# EAGLE design CanBusArduino (EAGLE 9.2.2)
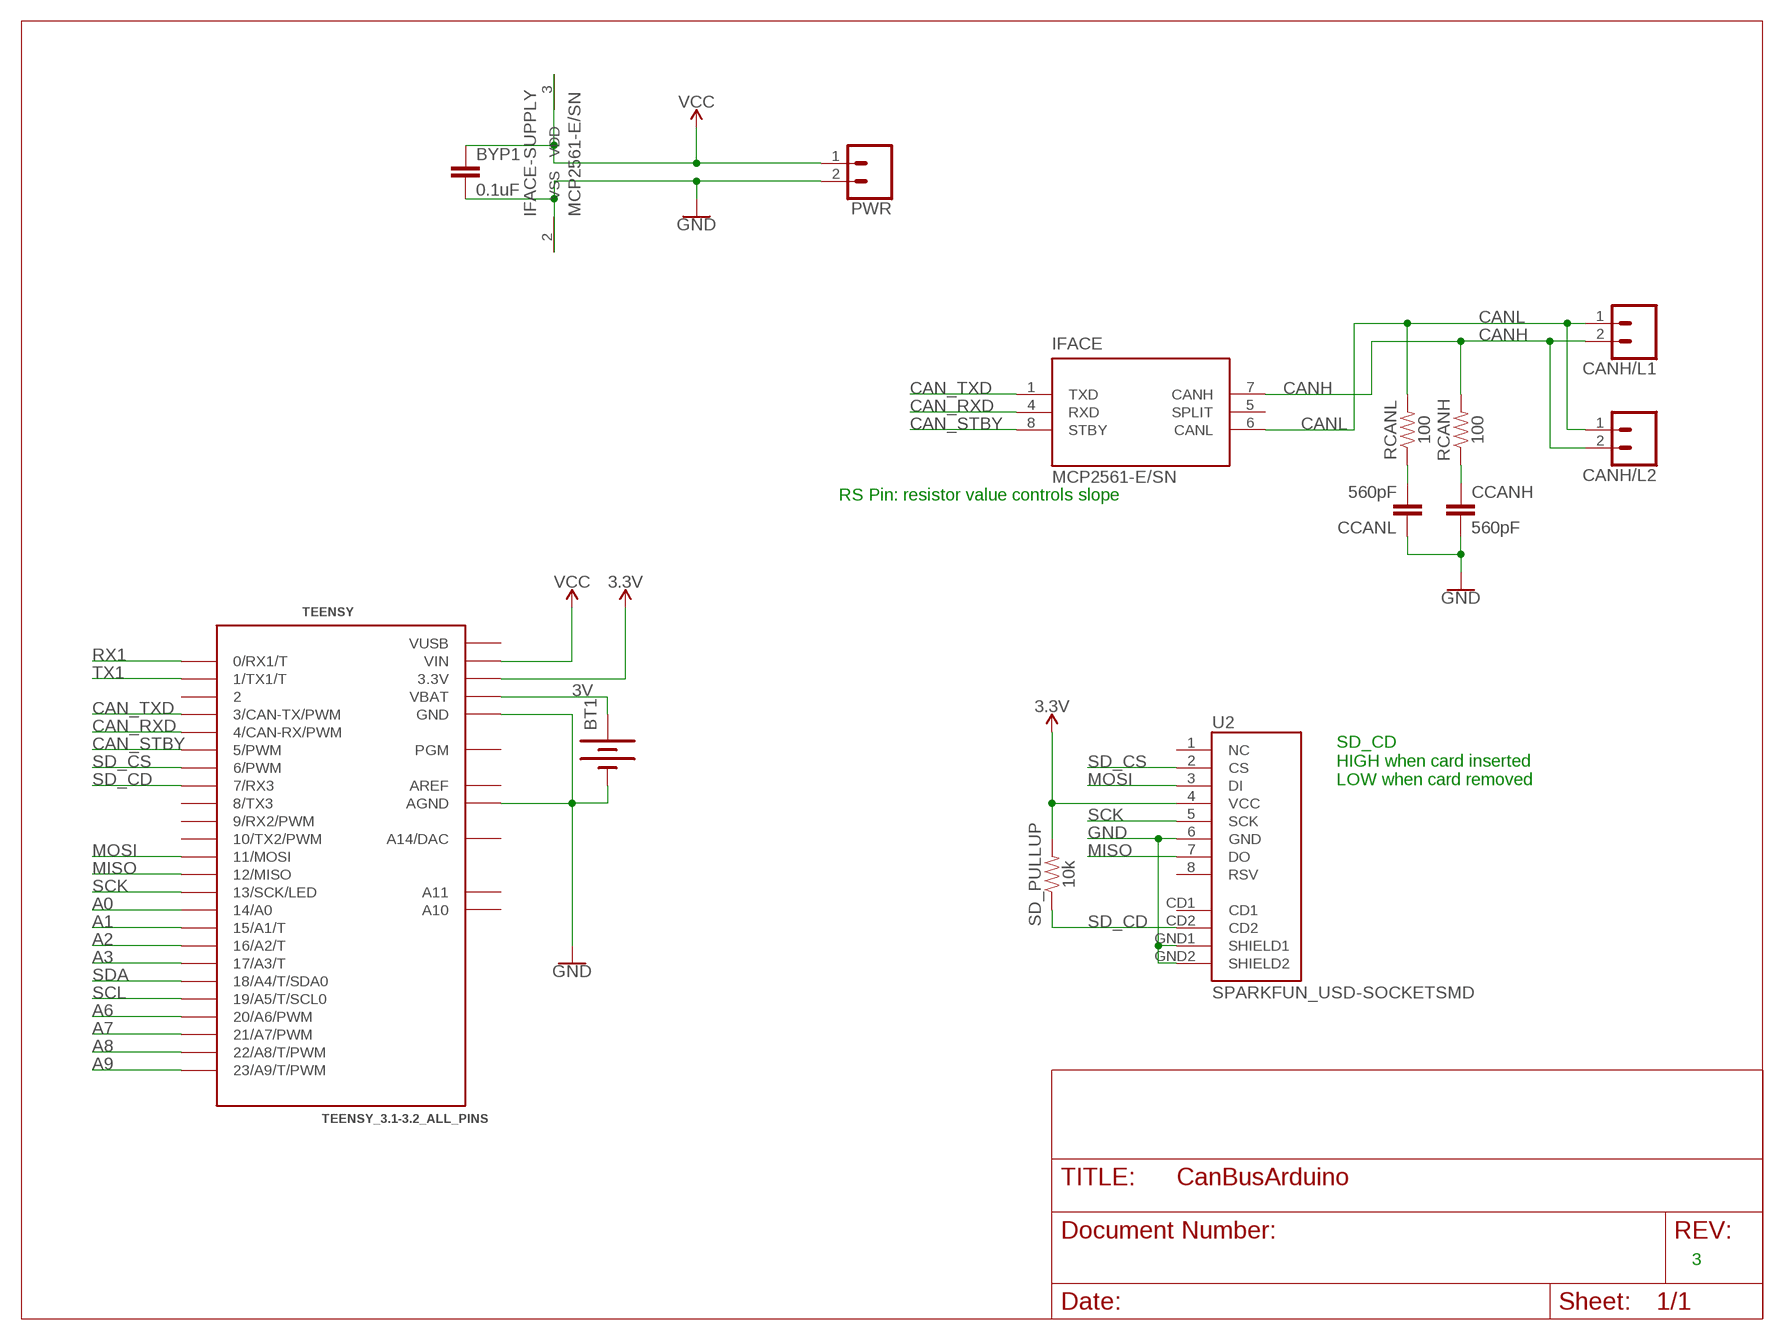
[diagram p0: schematic, sheet 1]

## Parts
BT1  BATTERY-20MM_SMD_4LEGS  [BATTCON_20MM_4LEGS]
BYP1  0.1uF  0.1UF-0603-100V-10%  [0603]
CANH/L1  CONN_02POLAR  [MOLEX-1X2]
CANH/L2  CONN_02POLAR  [MOLEX-1X2]
CCANH  560pF  560PF-0603-50V-5%  [0603]
CCANL  560pF  560PF-0603-50V-5%  [0603]
IFACE  MCP2561-E/SN  [SOIC-8]
PWR  CONN_02POLAR  [MOLEX-1X2]
RCANH  100  100OHM-0603-1/4W-5%  [0603]
RCANL  100  100OHM-0603-1/4W-5%  [0603]
SD_PULLUP  10k  10KOHM-0603-1/10W-1%  [0603]
TEENSY  TEENSY_3.1-3.2_ALL_PINS  [TEENSY_3.0-3.2&LC_ALL_PINS]
U2  SPARKFUN_USD-SOCKETSMD  [SPARKFUN_MICRO-SD-SOCKET-PP]

## Nets
3.3V: SD_PULLUP.2 TEENSY.3.3V TEENSY.3.3V1(3.3V) U2.4(VCC)
3V: BT1.POSITIVE@1(+) BT1.POSITIVE@2(+) BT1.POSITIVE@3(+) BT1.POSITIVE@4(+) TEENSY.VBAT
A0: TEENSY.14/A0
A1: TEENSY.15/A1(15/A1/T)
A2: TEENSY.16/A2(16/A2/T)
A3: TEENSY.17/A3(17/A3/T)
A6: TEENSY.20/A6(20/A6/PWM)
A7: TEENSY.21/A7(21/A7/PWM)
A8: TEENSY.22/A8(22/A8/T/PWM)
A9: TEENSY.23/A9(23/A9/T/PWM)
CAN_RXD: IFACE.4(RXD) TEENSY.4(4/CAN-RX/PWM)
CAN_STBY: IFACE.8(STBY) TEENSY.5(5/PWM)
CAN_TXD: IFACE.1(TXD) TEENSY.3(3/CAN-TX/PWM)
CANH: CANH/L1.2 CANH/L2.2 IFACE.7(CANH) RCANH.2
CANL: CANH/L1.1 CANH/L2.1 IFACE.6(CANL) RCANL.2
GND: BT1.NEGATIVE(-) BYP1.2 CCANH.2 CCANL.1 IFACE.2(VSS) PWR.2 TEENSY.AGND TEENSY.GND TEENSY.GND1(GND) U2.6(GND) U2.GND1(SHIELD1) U2.GND2(SHIELD2)
MISO: TEENSY.12(12/MISO) U2.7(DO)
MOSI: TEENSY.11(11/MOSI) U2.3(DI)
N$6: CCANL.2 RCANL.1
N$7: CCANH.1 RCANH.1
RX1: TEENSY.0(0/RX1/T)
SCK: TEENSY.13(13/SCK/LED) U2.5(SCK)
SCL: TEENSY.19/A5(19/A5/T/SCL0)
SD_CD: SD_PULLUP.1 TEENSY.7(7/RX3) U2.CD2
SD_CS: TEENSY.6(6/PWM) U2.2(CS)
SDA: TEENSY.18/A4(18/A4/T/SDA0)
TX1: TEENSY.1(1/TX1/T)
VCC [1A]: BYP1.1 IFACE.3(VDD) PWR.1 TEENSY.VIN
Unconnected: IFACE.5(SPLIT) TEENSY.2 TEENSY.8(8/TX3) TEENSY.9(9/RX2/PWM) TEENSY.10(10/TX2/PWM) TEENSY.A10 TEENSY.A11 TEENSY.PGM TEENSY.RESET/DAC(A14/DAC) U2.1(NC) U2.8(RSV) U2.CD1

## Notes on the sheet
- RS Pin: resistor value controls slope
- SD_CD
  HIGH when card inserted
  LOW when card removed
- 3

## Power pins joined to a net without a drawn wire
AREF: TEENSY.AREF
VUSB: TEENSY.VUSB

## Library data of the parts
BT1 = SparkFun-Batteries:BATTERY: Battery - Single Cell A variety of battery chemistries, sizes, and footprints. Device List: 20MM_PTH - Coin Cell Battery Holder - 20mm (PTH) <https://www.sparkfun.com/products/783> 6.8MM_PTH - Coin Cell Battery Holder - 6.8MM(SMD) <https://www.digikey.com/product-detail/en/seiko-instruments/MS621FE-FL11E/728-1057-ND/1889208?WT.srch=1&gclid=CNOQ5a6LzdQCFZS2wAodXCkE0g> 12MM_SMD - Coin Cell Battery Holder - 12mm (SMD) <https://www.sparkfun.com/products/10592> 12MM_PTH - Coin Cell Battery Holder - 12mm (PTH) <https://www.sparkfun.com/products/7948> 20MM_SMD - 20mm Coin Cell Battery Holder (SMD) (2 legs) Used on the Big Time Watch Kit <https://www.sparkfun.com/products/11734> 20MM_SMD_4LEGS - Coin Cell Battery Holder - 20mm (SMD) <https://www.sparkfun.com/products/11892> 20MM_SMD_4LEGS_OVERPASTE - Coin Cell Battery Holder - 20mm (SMD) <https://www.sparkfun.com/products/11892> (Over-paste on the legs) 24.5MM_PTH - Coin Cell Battery Holder - 24.5mm (PTH) <https://www.sparkfun.com/products/8863> 9V - 9V Battery Holder - PC Mount Used on the SparkFun SparkPunk Sound Kit <https://www.sparkfun.com/products/11177> and SparkFun SparkPunk Sequencer Kit <https://www.sparkfun.com/products/12707> 18650 - Battery Holder - 18650 (PTH) <https://www.sparkfun.com/products/13113> AA - Battery Holder - 1xAA (PTH) <https://www.sparkfun.com/products/7949> AAA - Battery Holder - 1xAAA (PTH) <https://www.sparkfun.com/products/12718> AA_KIT - Battery Holder - 1xAA (PTH) <https://www.sparkfun.com/products/7949> Special kit package - pads only have exposed copper on one side of the board. AAA_KIT - Battery Holder - 1xAAA (PTH) <https://www.sparkfun.com/products/12718> Special kit package - pads only have exposed copper on one side of the board.; PROD_ID: BATT-10373; SF_SKU: PRT-11892
BYP1 = SparkFun-Capacitors:0.1UF: 0.1µF ceramic capacitors A capacitor is a passive two-terminal electrical component used to store electrical energy temporarily in an electric field.; PROD_ID: CAP-08390
CANH/L1 CANH/L2 PWR = SparkFun-Connectors:CONN_02: Multi connection point. Often used as Generic Header-pin footprint for 0.1 inch spaced/style header connections On any of the 0.1 inch spaced packages, you can populate with these: Break Away Headers - Straight <https://www.sparkfun.com/products/116> (PRT-00116) Break Away Male Headers - Right Angle <https://www.sparkfun.com/products/553> (PRT-00553) Female Headers <https://www.sparkfun.com/products/115> (PRT-00115) Break Away Headers - Machine Pin <https://www.sparkfun.com/products/117> (PRT-00117) Break Away Female Headers - Swiss Machine Pin <https://www.sparkfun.com/products/743> (PRT-00743) For SCREWTERMINALS and SPRING TERMINALS visit here: Screw Terimnals on SparkFun.com <https://www.sparkfun.com/search/results?term=Screw+Terminals> (5mm/3.5mm/2.54mm spacing) This device is also useful as a general connection point to wire up your design to another part of your project. Our various solder wires solder well into these plated through hole pads. Hook-Up Wire - Assortment (Stranded, 22 AWG) <https://www.sparkfun.com/products/11375> (PRT-11375) Hook-Up Wire - Assortment (Solid Core, 22 AWG) <https://www.sparkfun.com/products/11367> (PRT-11367) View the entire wire category on our website here <https://www.sparkfun.com/categories/141> Special notes: Molex polarized connector foot print use with: PRT-08233 with associated crimp pins and housings. 2.54_SCREWTERM for use with PRT-10571. 3.5mm Screw Terminal footprints for PRT-08084 5mm Screw Terminal footprints for use with PRT-08432; SF_ID: PRT-09918
CCANH CCANL = SparkFun-Capacitors:560PF: 0.56nF/560pF ceramic capacitors A capacitor is a passive two-terminal electrical component used to store electrical energy temporarily in an electric field.; PROD_ID: CAP-08749
IFACE = Volks73-MicrochipTechnology:MCP2561-*/?: High-Speed CAN Transceiver Documentation Datasheet <http://ww1.microchip.com/downloads/en/DeviceDoc/20005167C.pdf> General Description The MCP2561/2 is a Microchip Technology Inc. second generation high-speed CAN transceiver. It serves as an interface between a CAN protocol controller and the physical two-wire CAN bus. The device meets the automotive requirements for high-speed (up to 1 Mb/s), low quiescent current, electromagnetic compatibility (EMC) and electrostatis discharge (ESD). Features Supports 1 Mb/s Operation Implements ISO-11898-2 and ISO-11898-5 Standard Physical Layer Requirements Very Low Standby Current (5 µA, typical) VIO Supply Pin to Interface Directly to CAN Controllers and Microcontrollers with 1.8V to 5.5V I/O SPLIT Output Pin to Stabilize Common Mode in Biased Split Termination Schemes CAN Bus Pins are Disconnected when Device is Unpowered: An Unpowered Node or Brown-Out Event will Not Load the CAN Bus Detection of Ground Fault: Permanent Dominant Detection on TXD Permanent Dominant Detection on Bus Power-on Reset and Voltage Brown-Out Protection on VDD Pin Protection Against Damage Due to Short-Circuit Conditions (Positive or Negative Battery Voltage) Protection Against High-Voltage Transients in Automotive Environments Automatic Thermal Shutdown Protection Suitable for 12V and 24V Systems Meets or exceeds stringent automotive design requirements including “Hardware Requirements for LIN, CAN and FlexRay Interfaces in Automotive Applications”, Version 1.3, May 2012 High-Noise Immunity Due to Differential Bus Implementation High Electrostatic Discharge (ESD) Protection on CANH and CANL, meeting the IEC61000-4-2 up to ±14 kV Available in PDIP-8L, SOIC-8L and 3x3 DFN-8L Temperature ranges: Extended (E): -40°C to +125°C High (H): -40°C to +150°C; CATEGORY: Integrated Circuits (ICs); DATA_RATE: -; DESCRIPTION: IC TXRX CAN 8SOIC; DOCUMENTATION_LINK: <a href="http://ww1.microchip.com/downloads/en/DeviceDoc/20005167C.pdf">Datasheet</a>; DOCUMENTATION_URL: http://ww1.microchip.com/downloads/en/DeviceDoc/20005167C.pdf; DUPLEX: Full; FAMILY: Interface - Drivers, Receivers, Transceivers; MANUFACTURER: Microchip Technology; MOUNTING_TYPE: Surface Mount; NUMBER_OF_DRIVERS-RECEIVERS: 1/1; OPERATING_TEMPERATURE: -40°C ~ 125°C; PACKAGE_CASE: 8-SOIC (0.154", 3.90mm Width); PART_NUMBER: MCP2561-E/SN; PROTOCOL: CAN; RECEIVER_HYSTERSIS: -; SERIES: -; SUPPLIER_DEVICE_PACKAGE: 8-SOIC N; SUPPLIER_ITEM_INFO: http://www.digikey.com/product-detail/en/MCP2561-E%2FSN/MCP2561-E%2FSN-ND/4079961; SUPPLIER_ITEM_LINK: <a href="http://www.digikey.com/product-detail/en/MCP2561-E%2FSN/MCP2561-E%2FSN-ND/4079961">Details</a>; SUPPLIER_ITEM_NUMBER: MCP2561-E/SN-ND; SUPPLIER_ITEM_URL: http://www.digikey.com/product-detail/en/MCP2561-E%2FSN/MCP2561-E%2FSN-ND/4079961; SUPPLIER_LINK: <a href="http://www.digikey.com">Home Page</a>; SUPPLIER_NAME: Digi-Key; SUPPLIER_URL: http://www.digikey.com; TYPE: Transceiver; VOLTAGE-SUPPLY: 4.5 V ~ 5.5 V
RCANH RCANL = SparkFun-Resistors:100OHM: 100Ω resistor A resistor is a passive two-terminal electrical component that implements electrical resistance as a circuit element. Resistors act to reduce current flow, and, at the same time, act to lower voltage levels within circuits. - Wikipedia; PROD_ID: RES-12438
SD_PULLUP = SparkFun-Resistors:10KOHM: 10kΩ resistor A resistor is a passive two-terminal electrical component that implements electrical resistance as a circuit element. Resistors act to reduce current flow, and, at the same time, act to lower voltage levels within circuits. - Wikipedia; PROD_ID: RES-00824
TEENSY = Teensy_3_and_LC_Series_Boards_v1.4:TEENSY_3.1-3.2_ALL_PINS: Footprint for Teensy 3.1 or 3.2 board using all through-holes, i.e. the entire perimeter plus the 4 through-holes inboard (A10,A11,AREF, VUSB)
U2 = microSD-Breakout-v14:SPARKFUN_USD-SOCKET: microSD Socket Push-push type uSD socket. Schematic element and footprint production proven. Spark Fun Electronics SKU : PRT-00127. tDoc lines correctly indicate media card edge positions when inserting (unlocked, locked, depressed).

## Net classes
1 1A: width 0.4 mm

## Board
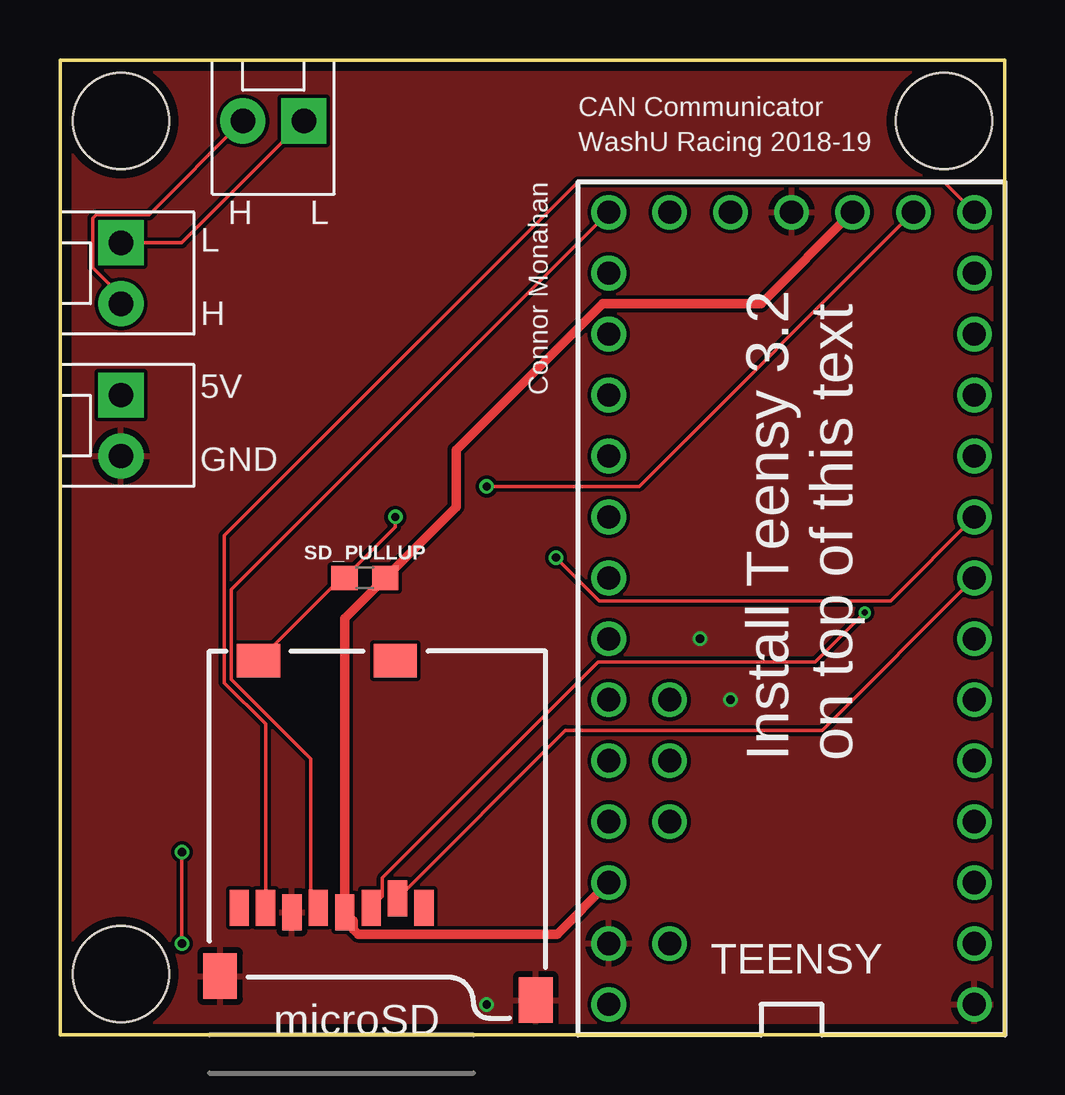
[diagram p1: board, top side]
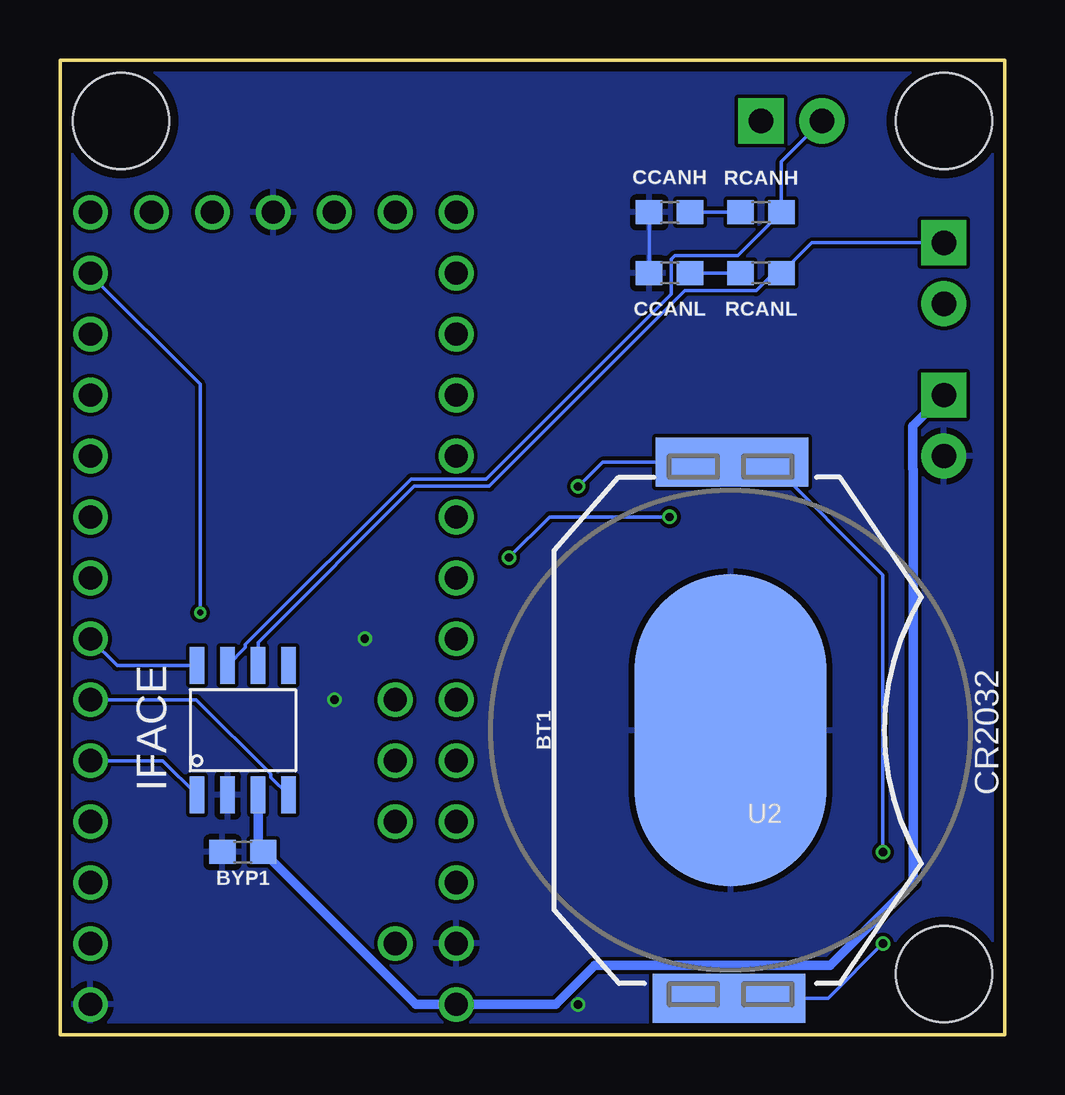
[diagram p2: board, bottom side, seen from below]

Size 39.37 x 40.64 mm. Coordinates in mm from the lower left corner, seen from the top.
Outline: 0,0 39.37,0 39.37,40.64 0,40.64 0,0
Copper layers (1*16): Top 0.035559375mm / dielectric 1.6mm / Bottom 0.035559375mm
Design rules "oshpark-2layer": minimum track width 6mil, minimum drill 10mil, track to track 6mil, track to pad 6mil, pad to pad 6mil, via to via 6mil, smd to smd 6mil, copper to edge 15mil, drill to drill 6mil, minimum pad ring 5mil, minimum via ring 5mil, stop-mask expansion 2.5mil, vias tented up to drill 0mil, thermal gap 10mil
Holes 4 mm at 36.83,38.1 2.54,2.54 2.54,38.1

### Footprints (pad centres in the part's own frame; a part is rotated, then mirrored left to right if it is on the bottom)
BATTCON_20MM_4LEGS = smd 13 x 8: NEGATIVE 0,0 | smd 2.032 x 3.175: POSITIVE@1 -11.176,1.651; POSITIVE@2 -11.176,-1.524; POSITIVE@3 11.176,1.524; POSITIVE@4 11.176,-1.651
0603 = smd 1.1 x 1: 1 -0.85,0; 2 0.85,0
MOLEX-1X2 = drill 1.016 pad 1.88 square: 1 0,0 | drill 1.016 pad 1.88: 2 2.54,0
SOIC-8 = smd 1.55 x 0.6: 1 -2.7,1.905; 2 -2.7,0.635; 3 -2.7,-0.635; 4 -2.7,-1.905; 5 2.7,-1.905; 6 2.7,-0.635; 7 2.7,0.635; 8 2.7,1.905
TEENSY_3.0-3.2&LC_ALL_PINS = drill 0.965: 0 -7.62,13.97; 1 -7.62,11.43; 2 -7.62,8.89; 3 -7.62,6.35; 3.3V 7.62,11.43; 3.3V1 -2.54,-16.51; 4 -7.62,3.81; 5 -7.62,1.27; 6 -7.62,-1.27; 7 -7.62,-3.81; 8 -7.62,-6.35; 9 -7.62,-8.89; 10 -7.62,-11.43; 11 -7.62,-13.97; 12 -7.62,-16.51; 13 7.62,-16.51; 14/A0 7.62,-13.97; 15/A1 7.62,-11.43; 16/A2 7.62,-8.89; 17/A3 7.62,-6.35; 18/A4 7.62,-3.81; 19/A5 7.62,-1.27; 20/A6 7.62,1.27; 21/A7 7.62,3.81; 22/A8 7.62,6.35; 23/A9 7.62,8.89; A10 5.08,6.35; A11 5.08,3.81; AGND 7.62,13.97; AREF 5.08,8.89; GND -7.62,16.51; GND1 0,-16.51; PGM 2.54,-16.51; RESET/DAC 5.08,-16.51; VBAT -5.08,-16.51; VIN 7.62,16.51; VUSB 5.08,13.97
SPARKFUN_MICRO-SD-SOCKET-PP = smd 0.8 x 1.5: 1 -8.94,10.7; 2 -7.84,10.3; 3 -6.74,10.7; 4 -5.64,10.9; 5 -4.54,10.7; 6 -3.44,10.9; 7 -2.34,10.7; 8 -1.24,10.7 | smd 1.8 x 1.4: CD1 -7.75,0.4; CD2 -2.05,0.4 | smd 1.4 x 1.9: GND1 -13.6,14.55; GND2 -0.45,13.55

### Placement (x,y rotation side)
BT1  11.43,12.7 90 bottom
BYP1  31.75,7.62 180 bottom
CANH/L1  2.54,33.02 270 top
CANH/L2  10.16,38.1 180 top
CCANH  13.97,34.29 180 bottom
CCANL  13.97,31.75 0 bottom
IFACE  31.75,12.7 90 bottom
PWR  2.54,26.67 270 top
RCANH  10.16,34.29 0 bottom
RCANL  10.16,31.75 0 bottom
SD_PULLUP  12.7,19.05 0 top
TEENSY  30.48,17.78 180 top
U2  6.22,16 180 top

### Tracks (layer width: path | path; a pad name or v marks a point on that pad's centre or on a via)
3.3V
  Top 0.4: TEENSY.3.3V 20.71,4.2 12.42,4.2 12.21,4.41 12.21,4.75 U2.4 11.86,17.36 SD_PULLUP.2 16.51,22.01 16.51,24.38 22.61,30.48 29.21,30.48 TEENSY.3.3V1
3V  (via drill 0.35)
  Top 0.152: TEENSY.VBAT 24.13,22.86 v17.78,22.86 | v5.08,7.62 v5.08,3.81
  Bottom 0.152: v5.08,7.62 5.08,19.18 BT1.POSITIVE@4 BT1.POSITIVE@3 16.76,23.88 v17.78,22.86 | v5.08,3.81 7.37,1.52 BT1.POSITIVE@2 BT1.POSITIVE@1
CAN_RXD
  Bottom 0.152: IFACE.4 30.59,10.74 30.59,10.87 33.69,13.97 TEENSY.4
CAN_STBY
  Bottom 0.152: IFACE.8 36.99,15.4 TEENSY.5
CAN_TXD
  Bottom 0.152: IFACE.1 35.09,11.43 TEENSY.3
CANH
  Top 0.152: CANH/L2.2 3.71,34.19 1.51,34.19 1.37,34.05 1.37,31.99 2.54,30.82 CANH/L1.2
  Bottom 0.152: IFACE.7 31.64,16.14 31.64,16.27 24.74,23.18 21.61,23.18 13.9,30.89 13.9,32.34 13.77,32.48 11.12,32.48 RCANH.2 9.31,36.41 CANH/L2.2
CANL
  Top 0.152: CANH/L2.1 5.08,33.02 CANH/L1.1
  Bottom 0.152: CANH/L1.1 8.04,33.02 RCANL.2 9.64,31.75 10.37,31.02 13.33,31.02 21.48,22.87 24.61,22.87 31.11,16.37 IFACE.6
GND  (via drill 0.35)
  Bottom 0.152: CCANH.2 CCANL.1
  other vias: 17.78,1.27 26.67,16.51 27.94,13.97
  pour Top: 39.37,0 0,0 0,40.64 39.37,40.64
  pour Bottom: 39.37,0 0,0 0,40.64 39.37,40.64
MISO
  Top 0.152: TEENSY.12 36.83,35.56 21.59,35.56 6.84,20.81 6.84,14.68 8.56,12.96 U2.7
MOSI  (via drill 0.25)
  Top 0.152: v33.53,17.6 31.47,15.54 22.43,15.54 13.43,6.55 13.43,5.77 U2.3
  Bottom 0.152: v33.53,17.6 33.53,27.13 38.1,31.7 TEENSY.11
N$6
  Bottom 0.152: CCANL.2 RCANL.1
N$7
  Bottom 0.152: RCANH.1 CCANH.1
SCK
  Top 0.152: U2.5 10.44,5.33 10.44,11.51 7.14,14.81 7.14,18.57 TEENSY.13
SD_CD  (via drill 0.35)
  Top 0.152: v20.66,19.9 22.46,18.1 34.61,18.1 TEENSY.7 | U2.CD2 11.72,19.05 SD_PULLUP.1 13.97,21.17 v13.97,21.59
  Bottom 0.152: v13.97,21.59 18.97,21.59 v20.66,19.9
SD_CS
  Top 0.152: U2.2 21.06,12.7 31.75,12.7 TEENSY.6
VCC
  Bottom 0.4: IFACE.3 31.11,7.83 BYP1.1 24.55,1.27 TEENSY.VIN 18.7,1.27 17.08,2.89 7.27,2.89 3.81,6.35 3.81,23.57 3.83,23.59 3.83,25.38 PWR.1

### Text on the board
tPlace: CAN Communicator / WashU Racing 2018-19 | H L | Connor Monahan | L / H / 5V / GND | Install Teensy 3.2 / on top of this text | microSD
bPlace: CR2032